# EAGLE board ascender_board (EAGLE 9.0.0)
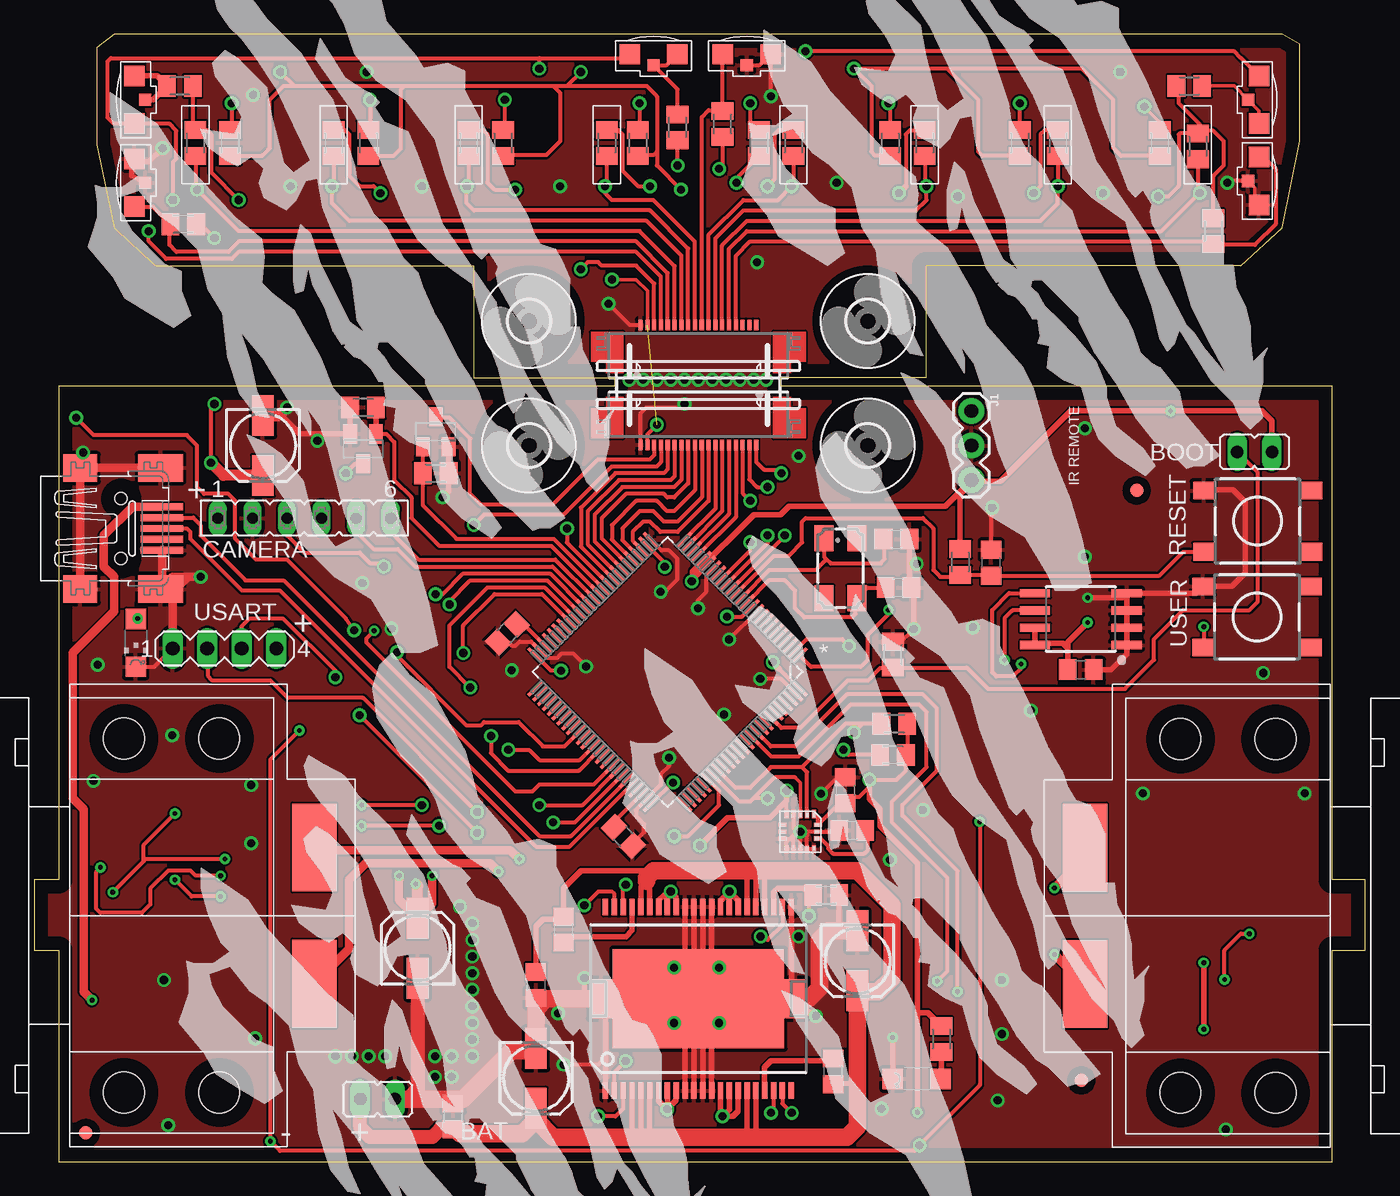
[diagram p2: board, top side]
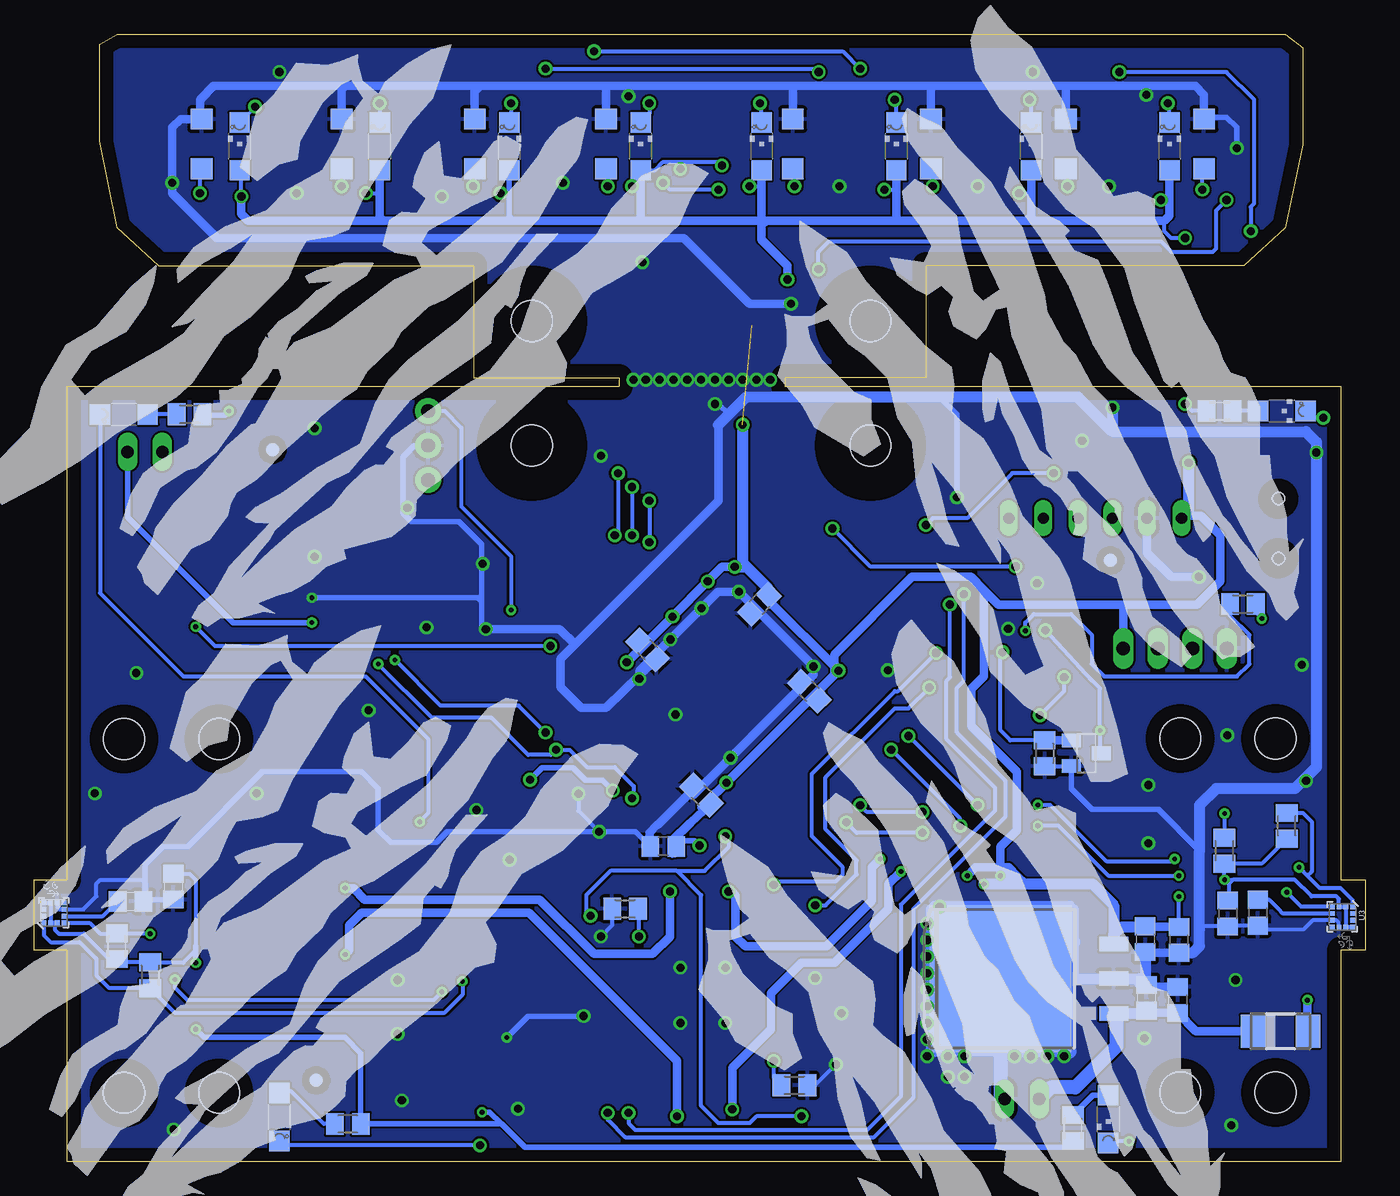
[diagram p3: board, bottom side, seen from below]

Size 97.84 x 82.85 mm. Coordinates in mm from the lower left corner, seen from the top.
Outline: 88.7,65.84 91.75,68.63 93.02,74.98 93.02,82.09 91.75,82.86 5.89,82.86 4.62,81.84 4.62,74.73 5.89,68.63 8.94,65.84 32.31,65.84 32.31,57.61 42.67,57.61 42.67,57 1.83,57 1.83,20.73 0,20.73 0,15.54 1.83,15.54 1.83,0 95.4,0 95.4,15.54 97.84,15.54 97.84,20.73 95.4,20.73 95.4,57 54.86,57 54.86,57.61 65.53,57.61 65.53,65.84 88.7,65.84
Copper layers (1*16): Top 0.035mm / dielectric 1.5mm / Bottom 0.035mm
Design rules "default *": minimum track width 8mil, minimum drill 24mil, track to track 6mil, track to pad 6mil, pad to pad 6mil, via to via 6mil, smd to smd 0mil, copper to edge 40mil, drill to drill 8mil, minimum pad ring 10mil, minimum via ring 8mil, stop-mask expansion 4mil, vias tented up to drill 0mil, thermal gap 10mil

## Footprints (pad centres in the part's own frame; a part is rotated, then mirrored left to right if it is on the bottom)
JP1 = drill 0.914 long: 1 0,-1.27; 2 0,1.27
C0805 = smd 1.3 x 1.5: 1 -0.95,0; 2 0.95,0
153CLV-0505 = smd 3 x 1.6: + 2.2,0; - -2.2,0
FE06 = drill 0.813 long: 1 -6.35,0; 2 -3.81,0; 3 -1.27,0; 4 1.27,0; 5 3.81,0; 6 6.35,0
DO-214AC = smd 1.8 x 2.4: A 2.025,0; C -2.025,0
3,0 = hole 3: 0,0
TO263-3 = smd 1.067 x 2.159: 1 -2.54,-5.791; 2 0,-5.791; 3 2.54,-5.791 | smd 10.8 x 10.41: TAB 0,2.54
HSOP44 = smd 0.4 x 1.2: 1 -6.825,-6.75; 2 -6.175,-6.75; 3 -5.525,-6.75; 4 -4.875,-6.75; 5 -4.225,-6.75; 6 -3.575,-6.75; 7 -2.925,-6.75; 8 -2.275,-6.75; 9 -1.625,-6.75; 10 -0.975,-6.75; 11 -0.325,-6.75; 12 0.325,-6.75; 13 0.975,-6.75; 14 1.625,-6.75; 15 2.275,-6.75; 16 2.925,-6.75; 17 3.575,-6.75; 18 4.225,-6.75; 19 4.875,-6.75; 20 5.525,-6.75; 21 6.175,-6.75; 22 6.825,-6.75; 23 6.825,6.75; 24 6.175,6.75; 25 5.525,6.75; 26 4.875,6.75; 27 4.225,6.75; 28 3.575,6.75; 29 2.925,6.75; 30 2.275,6.75; 31 1.625,6.75; 32 0.975,6.75; 33 0.325,6.75; 34 -0.325,6.75; 35 -0.975,6.75; 36 -1.625,6.75; 37 -2.275,6.75; 38 -2.925,6.75; 39 -3.575,6.75; 40 -4.225,6.75; 41 -4.875,6.75; 42 -5.525,6.75; 43 -6.175,6.75; 44 -6.825,6.75 | smd 12.6 x 7.3: EH@1 0,0 | smd 1.7 x 2.9: EH@2 -7.15,0; EH@3 7.15,0
1X03 = drill 1.016 pad 1.88: 1 0,0; 2 2.54,0; 3 5.08,0
CHIPLED_1206 = smd 1.5 x 1.5: A 0,-1.75; C 0,1.75
CTS406 = smd 1.9 x 1.4: 1 -2.2,-1.2; 2 2.2,-1.2; 3 2.2,1.2; 4 -2.2,1.2
SOT23 = smd 1 x 1.4: 1 -0.95,-1.1; 2 0.95,-1.1; 3 0,1.1
M0805 = smd 1.3 x 1.6: 1 -0.95,0; 2 0.95,0
DTSM-6 = smd 1.55 x 1.3: 1 -3.975,2.25; 2 3.975,2.25; 3 -3.975,-2.25; 4 3.975,-2.25
QFP50P1600X1600X160-100N = smd 1.473 x 0.254: 1 -7.722,5.994; 2 -7.722,5.512; 3 -7.722,5.004; 4 -7.722,4.496; 5 -7.722,3.988; 6 -7.722,3.505; 7 -7.722,2.997; 8 -7.722,2.489; 9 -7.722,2.007; 10 -7.722,1.499; 11 -7.722,0.991; 12 -7.722,0.508; 13 -7.722,0; 14 -7.722,-0.508; 15 -7.722,-0.991; 16 -7.722,-1.499; 17 -7.722,-2.007; 18 -7.722,-2.489; 19 -7.722,-2.997; 20 -7.722,-3.505; 21 -7.722,-3.988; 22 -7.722,-4.496; 23 -7.722,-5.004; 24 -7.722,-5.512; 25 -7.722,-5.994; 51 7.722,-5.994; 52 7.722,-5.512; 53 7.722,-5.004; 54 7.722,-4.496; 55 7.722,-3.988; 56 7.722,-3.505; 57 7.722,-2.997; 58 7.722,-2.489; 59 7.722,-2.007; 60 7.722,-1.499; 61 7.722,-0.991; 62 7.722,-0.508; 63 7.722,0; 64 7.722,0.508; 65 7.722,0.991; 66 7.722,1.499; 67 7.722,2.007; 68 7.722,2.489; 69 7.722,2.997; 70 7.722,3.505; 71 7.722,3.988; 72 7.722,4.496; 73 7.722,5.004; 74 7.722,5.512; 75 7.722,5.994 | smd 0.254 x 1.473: 26 -5.994,-7.722; 27 -5.512,-7.722; 28 -5.004,-7.722; 29 -4.496,-7.722; 30 -3.988,-7.722; 31 -3.505,-7.722; 32 -2.997,-7.722; 33 -2.489,-7.722; 34 -2.007,-7.722; 35 -1.499,-7.722; 36 -0.991,-7.722; 37 -0.508,-7.722; 38 0,-7.722; 39 0.508,-7.722; 40 0.991,-7.722; 41 1.499,-7.722; 42 2.007,-7.722; 43 2.489,-7.722; 44 2.997,-7.722; 45 3.505,-7.722; 46 3.988,-7.722; 47 4.496,-7.722; 48 5.004,-7.722; 49 5.512,-7.722; 50 5.994,-7.722; 76 5.994,7.722; 77 5.512,7.722; 78 5.004,7.722; 79 4.496,7.722; 80 3.988,7.722; 81 3.505,7.722; 82 2.997,7.722; 83 2.489,7.722; 84 2.007,7.722; 85 1.499,7.722; 86 0.991,7.722; 87 0.508,7.722; 88 0,7.722; 89 -0.508,7.722; 90 -0.991,7.722; 91 -1.499,7.722; 92 -2.007,7.722; 93 -2.489,7.722; 94 -2.997,7.722; 95 -3.505,7.722; 96 -3.988,7.722; 97 -4.496,7.722; 98 -5.004,7.722; 99 -5.512,7.722; 100 -5.994,7.722
SO08-EIAJ = smd 0.61 x 2.21: 1 -1.905,-3.378; 2 -0.635,-3.378; 3 0.635,-3.378; 4 1.905,-3.378; 5 1.905,3.353; 6 0.635,3.353; 7 -0.635,3.353; 8 -1.905,3.353
SPARKFUN-DIGITALIC_LGA-12 = smd 0.375 x 0.35: 1 -0.75,0.75; 2 -0.75,0.25; 3 -0.75,-0.25; 4 -0.75,-0.75; 7 0.75,-0.75; 8 0.75,-0.25; 9 0.75,0.25; 10 0.75,0.75 | smd 0.35 x 0.375: 5 -0.25,-0.75; 6 0.25,-0.75; 11 0.25,0.75; 12 -0.25,0.75
ST_LGA16L = smd 0.6 x 0.3: P$1 -1.3,1; P$2 -1.3,0.5; P$3 -1.3,0; P$4 -1.3,-0.5; P$5 -1.3,-1; P$9 1.3,-1; P$10 1.3,-0.5; P$11 1.3,0; P$12 1.3,0.5; P$13 1.3,1 | smd 0.3 x 0.6: P$6 -0.5,-1.3; P$7 0,-1.3; P$8 0.5,-1.3; P$14 0.5,1.3; P$15 0,1.3; P$16 -0.5,1.3
FIDUCIAL_1MM = smd 1 x 1: 1 0,0
SFH3710 = smd 1.52 x 1.6: P$1 -1.75,0; P$2 1.9,0
KPA3010 = smd 1.5 x 1.5: P$1_COL -1.75,0.8; P$2_EM 1.75,0.8 | smd 0.9 x 0.9: P$3-NC 0,0
JSUMO_MOTOR_WITH_WHEEL = smd 3.251 x 6.452: P$1 18,5; P$2 18,-5 | hole 3: 4,-13; 11,-13; 4,13; 11,13
MA04-1 = drill 1.016 long: 1 -3.81,0; 2 -1.27,0; 3 1.27,0; 4 3.81,0
52745-1890 = smd 0.3 x 0.8: 1 -4.25,2.5; 2 -3.75,2.5; 3 -3.25,2.5; 4 -2.75,2.5; 5 -2.25,2.5; 6 -1.75,2.5; 7 -1.25,2.5; 8 -0.75,2.5; 9 -0.25,2.5; 10 0.25,2.5; 11 0.75,2.5; 12 1.25,2.5; 13 1.75,2.5; 14 2.25,2.5; 15 2.75,2.5; 16 3.25,2.5; 17 3.75,2.5; 18 4.25,2.5
32005-201 = smd 3.1 x 0.5: 1 3,1.6; 2 3,0.8; 3 3,0; 4 3,-0.8; 5 3,-1.6 | smd 2.5 x 2: M1 -3,-4.45; M2 -3,4.45 | smd 3.3 x 2: M3 2.9,4.45; M4 2.9,-4.45 | hole 0.9: 0,2.2; 0,-2.2

## Placement (x,y rotation side)
BAT  LiPol  [JP1]  25.25,4.62 90 top
BOOT  [JP1]  89.69,52.17 270 top
C1  [C0805]  63.37,45.75 0 top
C2  18p  [C0805]  63.52,42.19 0 top
C3  100n  [C0805]  70.33,44.02 90 top
C4  2.2uF  [C0805]  34.77,38.84 225 top
C5  2.2uF  [C0805]  43.31,23.9 135 top
C6  100n  [C0805]  44.53,40.97 225 bottom
C7  100n  [C0805]  40.87,34.57 135 bottom
C8  100n  [C0805]  48.79,26.95 135 bottom
C9  100n  [C0805]  52.75,37.62 315 bottom
C10  100n  [C0805]  16.09,12.06 90 bottom
C11  10uF  [C0805]  13.8,11.9 90 bottom
C12  100n  [C0805]  13.7,16.32 270 bottom
C13  10uF  [C0805]  16.19,16.37 270 bottom
C14  10n  [C0805]  60.12,24.36 180 top
C15  100n  [C0805]  59.61,27.31 90 top
C16  100n  [C0805]  51.6,23.18 180 bottom
C17  100n  [C0805]  38.91,17.07 270 top
C18  100n  [C0805]  58.72,6.65 270 top
C19  100n  [C0805]  36.88,13 270 top
C20  [153CLV-0505]  36.88,6.15 270 top
C21  [153CLV-0505]  60.5,14.78 270 top
C22  [153CLV-0505]  28.19,15.7 90 top
C23  100n  [C0805]  30.78,3.35 90 top
C24  [153CLV-0505]  16.81,52.63 270 top
C25  100n  [C0805]  7.91,18.3 270 bottom
C26  100n  [C0805]  76.91,36.17 0 top
C27  100n  [C0805]  10.12,18.25 270 bottom
C28  100n  [C0805]  90.75,19.15 0 bottom
C29  100n  [C0805]  87.61,20.22 270 bottom
CAMERA  [FE06]  19.86,47.29 0 top
D1  [DO-214AC]  6.25,9.6 0 bottom
H1  MOUNT-HOLE3.0  [3,0]  61.26,61.77 0 top
H2  MOUNT-HOLE3.0  [3,0]  36.37,61.77 0 top
H3  MOUNT-HOLE3.0  [3,0]  61.26,52.63 0 top
H4  MOUNT-HOLE3.0  [3,0]  36.37,52.63 0 top
IC1  LM2937  [TO263-3]  24.28,13.46 90 bottom
IC2  MC33932  [HSOP44]  48.82,11.99 0 top
J1  455-1750-1-ND  [1X03]  68.88,55.17 270 top
LED1  [CHIPLED_1206]  7.48,38.13 180 top
LED2  [CHIPLED_1206]  64.86,6.11 90 top
LED3  [CHIPLED_1206]  6.15,55.17 270 bottom
LED4  [CHIPLED_1206]  91.24,54.91 90 bottom
LED5  [CHIPLED_1206]  79.81,3.3 180 bottom
LED6  [CHIPLED_1206]  18.9,3.15 180 bottom
LED7  [CHIPLED_1206]  82.73,74.6 0 bottom
LED8  [CHIPLED_1206]  72.44,74.6 0 bottom
LED9  [CHIPLED_1206]  62.92,74.6 0 bottom
LED10  [CHIPLED_1206]  53.26,74.6 0 bottom
LED11  [CHIPLED_1206]  44.37,74.6 0 bottom
LED12  [CHIPLED_1206]  34.47,74.6 0 bottom
LED13  [CHIPLED_1206]  24.56,74.6 0 bottom
LED14  [CHIPLED_1206]  14.4,74.6 0 bottom
Q1  8MHz  [CTS406]  59.26,43.61 270 top
Q2  BSS123  [SOT23]  24.18,52.37 180 top
Q3  BSS123  [SOT23]  29.51,53.64 0 top
Q4  BSS123  [SOT23]  20.52,30.02 270 bottom
R1  4k7  [M0805]  68.05,44.07 90 top
R2  4k7  [M0805]  63.12,37.26 270 top
R3  4k7  [M0805]  9,40.98 180 bottom
R4  4k7  [M0805]  63.12,29.9 0 top
R5  4k7  [M0805]  63.22,32.18 0 top
R6  4k7  [M0805]  66.68,9.03 90 top
R7  4k7  [M0805]  58.22,19.61 180 top
R8  4k7  [M0805]  41.96,5.64 180 bottom
R9  4k7  [M0805]  54.41,18.59 180 bottom
R10  4k7  [M0805]  24.18,55.42 0 top
R11  4k7  [M0805]  29.51,50.6 180 top
R12  4k7  [M0805]  23.57,30.02 90 bottom
R13  330  [M0805]  10.72,55.17 180 bottom
R14  330  [M0805]  86.41,54.91 0 bottom
R15  330  [M0805]  74.78,2.79 0 bottom
R16  330  [M0805]  21.49,2.49 270 bottom
R17  4k7  [M0805]  5.79,24.69 270 bottom
R18  4k7  [M0805]  85.52,74.6 90 top
R19  330  [M0805]  82.73,74.85 90 top
R20  4k7  [M0805]  75.23,74.85 90 top
R21  330  [M0805]  72.44,74.85 90 top
R22  4k7  [M0805]  65.46,74.85 90 top
R23  330  [M0805]  62.92,74.85 90 top
R24  4k7  [M0805]  55.8,74.85 90 top
R25  330  [M0805]  53.26,74.85 90 top
R26  4k7  [M0805]  42.09,74.85 90 top
R27  330  [M0805]  44.37,74.85 90 top
R28  4k7  [M0805]  31.93,74.85 90 top
R29  330  [M0805]  34.47,74.85 90 top
R30  4k7  [M0805]  22.02,74.85 90 top
R31  330  [M0805]  24.56,74.85 90 top
R32  4k7  [M0805]  11.86,74.85 90 top
R33  330  [M0805]  14.4,74.85 90 top
R34  4k7  [M0805]  86.66,68.38 90 top
R35  22  [M0805]  47.29,76 270 top
R36  4k7  [M0805]  50.6,76.25 270 top
R37  22  [M0805]  10.72,79.04 0 top
R38  4k7  [M0805]  10.97,68.88 0 top
R39  22  [M0805]  84.89,79.04 180 top
R40  4k7  [M0805]  10.36,22.86 270 bottom
R41  4k7  [M0805]  89.31,13.72 90 bottom
R42  4k7  [M0805]  91.74,15.85 270 bottom
RESET  DTSM-6  [DTSM-6]  89.92,47.07 0 top
RUN  DTSM-6  [DTSM-6]  89.87,40.03 0 top
U1  STM32F722XX  [QFP50P1600X1600X160-100N]  46.56,35.99 225 top
U2  I2C EEPROM  [SO08-EIAJ]  76.91,39.88 90 top
U3  SPARKFUN-DIGITALIC_LSM303C  [SPARKFUN-DIGITALIC_LGA-12]  1.7,18 270 bottom
U4  SPARKFUN-DIGITALIC_LSM303C  [SPARKFUN-DIGITALIC_LGA-12]  96.38,18.3 90 bottom
U$1  [SCAR]  25.4,41.5 225 top
U$2  ST_L3GD20H  [ST_LGA16L]  56.31,24.26 270 top
U$3  FIDUCIAL  [FIDUCIAL_1MM]  76.96,5.99 0 top
U$4  FIDUCIAL  [FIDUCIAL_1MM]  81.03,49.33 0 top
U$5  FIDUCIAL  [FIDUCIAL_1MM]  3.81,2.13 0 top
U$6  FIDUCIAL  [FIDUCIAL_1MM]  18.75,44.2 0 bottom
U$7  FIDUCIAL  [FIDUCIAL_1MM]  77.11,5.99 0 bottom
U$8  FIDUCIAL  [FIDUCIAL_1MM]  80.31,52.32 0 bottom
U$9  [SCAR]  28.46,89.05 225 bottom  (outside the outline)
U$10  [SCAR]  34.25,43.94 225 bottom
U$11  SFH3710  [SFH3710]  85.52,74.85 270 bottom
U$12  KPA3010  [KPA3010]  89.2,72.06 270 top
U$13  KPA3010_EM  [KPA3010]  45.52,80.57 0 top
U$14  SFH3710  [SFH3710]  75.23,74.85 270 bottom
U$15  SFH3710  [SFH3710]  65.46,74.85 270 bottom
U$16  SFH3710  [SFH3710]  55.8,74.85 270 bottom
U$17  SFH3710  [SFH3710]  42.09,74.85 270 bottom
U$18  SFH3710  [SFH3710]  31.93,74.85 270 bottom
U$19  SFH3710  [SFH3710]  22.02,74.85 270 bottom
U$20  SFH3710  [SFH3710]  11.86,74.85 270 bottom
U$21  [SCAR]  66.75,103.06 225 top  (outside the outline)
U$22  [SCAR]  18.7,98.49 225 top  (outside the outline)
U$23  [SCAR]  49.73,31.89 150 bottom
U$24  [SCAR]  58.02,57.65 225 top
U$26  JSUMO_MOTOR_WITH_WHEEL  [JSUMO_MOTOR_WITH_WHEEL]  2.61,18.1 0 top
U$27  JSUMO_MOTOR_WITH_WHEEL  [JSUMO_MOTOR_WITH_WHEEL]  95.24,18.07 180 top
U$28  [SCAR]  44.54,74.57 150 bottom
U$29  KPA3010  [KPA3010]  52.37,80.57 0 top
U$30  KPA3010_EM  [KPA3010]  8.18,78.03 90 top
U$31  KPA3010  [KPA3010]  8.18,71.93 90 top
U$32  KPA3010_EM  [KPA3010]  89.2,78.03 270 top
USART  [MA04-1]  14,37.72 0 top
X2  52745-1890  [52745-1890]  48.82,55.17 180 top
X3  52745-1890  [52745-1890]  48.82,58.98 0 top
X4  MINI-USB-SCHIELD-32005-201  [32005-201]  6.4,46.53 0 top

## Tracks (layer width: path | path; a pad name or v marks a point on that pad's centre or on a via)
+3V3  (via drill 0.35, 0.6)  (1 unrouted)
  Top 0.254: v42.47,64.82 44.25,64.82 45.07,64 X3.2 | R39.2 83.94,78.47
  Top 0.305: U1.100 56.21,34.77 v54.28,36.7 55.19,35.79 | v38.73,36.09 37.98,36.09 U1.50 | v46.35,43.72 46.35,43.99 U1.27 | v50.93,40.06 52.02,40.06 U1.11 | 48.34,42.73 48.34,42.98 48.34,43.41 U1.21 | U1.20 49.54,43.85 v48.34,42.65 | v46.96,27.87 46.91,27.87 U1.75 | U$2.P$1 57.61,25.26 U$2.P$16 59.31,26.46 C15.1 59.95,26.8 60.63,26.8 61.39,27.56 v61.39,28.07 63.38,28.07 64.06,28.75 64.06,29.26 | U$2.P$5 55.31,26.52 | R5.2 64.17,29.37 64.06,29.26 | 64.06,29.26 64.06,29.89 R4.2 | v13.01,51.36 13.01,55.42 v13.26,55.68 | X2.17 45.07,53.45 v45.77,54.15 | R37.2 11.67,76 R32.2 12.69,75.8 13.01,75.49 13.01,72.69 v15.04,70.66 | R38.2 12.24,68.89 v13.26,67.87 | R30.2 22.85,75.8 23.16,75.49 23.16,72.44 23.93,71.68 24.94,71.68 v25.45,71.17 | R28.2 33.01,75.8 33.33,75.49 33.33,71.93 33.83,71.42 v35.36,71.42 | R26.2 42.92,75.8 43.23,75.49 43.23,72.82 44.37,71.68 v45.26,71.68 | v47.3,73.2 R35.2 | R36.2 50.6,73.2 v50.34,72.95 | R24.2 54.72,75.8 54.41,75.49 54.41,72.19 v53.9,71.68 | R20.2 74.28,75.8 73.97,75.49 73.97,71.68 v73.46,71.17 | 64.06,71.68 64.06,75.49 64.37,75.8 R22.2 | R34.2 86.67,72.44 87.43,73.2 87.43,74.98 86.67,75.74 85.72,75.74 85.65,75.68 | 85.65,75.68 R18.2 84.19,75.55 84.12,75.49 84.12,71.68 83.36,70.92 v82.6,70.92 | 85.65,75.68 85.65,76.25 84.12,77.78 84.12,78.86 R39.2 | v13.72,19.51 11.58,19.51 v10.36,20.73
  Top 0.406: 54.79,36.2 v54.28,36.7 | U2.8 73.56,38.1 | 73.56,38.1 U2.7 | 64.06,71.68 v63.55,71.17 | v48.95,23.24 50.98,25.27 54.07,25.27 55.31,26.52 v55.31,27.29 | 73.56,38.1 75.59,38.1 75.96,37.73 C26.1 75.96,38.17 v77.42,39.62 | BOOT.2 90.96,54.43 90.22,55.17 v83.52,55.17 76.2,55.17 71.02,49.99 68.99,49.99 | 68.99,49.99 J1.3 66.95,48.16 55.47,48.16 54.86,47.55 52.91,47.55 48.55,43.19 | R1.2 68.05,49.05 68.99,49.99 | v48.34,42.65 48.34,42.73 48.55,42.95 48.55,43.19 | 48.55,43.19 48.34,42.98 | v61.39,28.07 61.39,26.7 62.18,25.91 62.18,24.69 64.92,21.95 64.92,10.97 | 64.92,10.97 v64.92,3.66 | R6.2 65.69,10.97 64.92,10.97 | v85.95,9.75 v85.95,14.63
  Top 0.61: v26.82,21.03 26.82,19.27 C22.+ 29.26,18.96 v29.26,21.03
  Top 0.813: C24.+ 13.94,50.43 v13.01,51.36 | C22.+ 28.19,20.27 v28.04,20.42
  Bottom 0.305: 39.04,36.4 v38.73,36.09 | C7.1 40.55,34.27 39.95,34.88 | C6.1 43.92,41.28 43.61,40.97 | C9.1 53.05,38.22 52.91,38.08 | C8.1 48.34,26.49 | 50.75,22.68 50.94,22.48 | R13.2 12.75,55.17 v13.26,55.68 | 44.53,72.69 LED11.A | v15.04,70.66 14.4,70.66 | v13.26,67.87 14.28,67.87 14.78,68.38 14.78,69.27 14.4,69.65 | v25.45,71.17 24.56,71.17 | v35.36,71.42 34.47,71.42 | v45.26,71.68 44.37,71.68 | LED10.A 52.22,72.85 51.61,73.46 50.34,73.46 | 50.34,73.46 47.55,73.46 v47.3,73.2 | v50.34,72.95 50.34,73.46 | v53.9,71.68 53.26,71.68 | v73.46,71.17 72.44,71.17 | v82.6,70.92 82.6,72.72 | R14.2 85.39,54.85 | U4.3 96.32,17.55 | 96.32,17.55 U4.2 U4.9 U4.10 | U3.10 U3.9 U3.2 U3.3 1.95,19.32 2.13,19.51 3.96,19.51 5.18,20.73 9.75,20.73 | 9.75,20.73 10.06,20.42 10.06,19.27 C27.1 | C12.1 13.7,19.49 v13.72,19.51 | 9.75,20.73 v10.36,20.73 R40.2 7.62,21.91 R17.2 | 96.32,17.55 96.32,17.07 96.01,16.76 94.18,16.76 92.32,14.9 R42.2 91.51,14.67 R41.2 89.27,14.63 86.87,14.63 85.95,15.54 85.95,15.85 85.95,20.73 86.4,21.17 C29.1
  Bottom 0.406: LED9.A 62.92,71.17 | 62.92,71.17 62.92,69.52 62.53,69.14 | 62.92,71.17 v63.55,71.17 | 63.5,2.79 R15.2 73.83,7.99 74.98,9.14 85.34,9.14 v85.95,9.75 | 63.5,2.79 61.77,1.07 21.96,1.07 R16.2 | 50.94,23.6 49.3,23.6 v48.95,23.24 | v55.31,27.29 56.06,28.04 57.3,28.04 58.22,28.96 60.5,28.96 v61.39,28.07 | 85.39,54.85 83.83,54.85 v83.52,55.17 | v77.42,39.62 83.21,39.62 90.96,47.37 BOOT.2 | 63.5,2.79 64.36,3.66 v64.92,3.66 | v85.95,14.63 85.95,15.85
  Bottom 0.61: v54.28,36.7 52.91,38.08 v50.93,40.06 v48.34,42.65 47.27,43.72 v46.35,43.72 | 43.61,40.97 39.04,36.4 | 39.04,36.4 39.04,35.79 39.95,34.88 v46.96,27.87 48.34,26.49 48.79,26.04 | C8.1 49.61,24.93 50.94,23.6 50.75,23.4 C16.1 50.75,22.68 | 39.04,36.4 39.04,37.26 33.33,42.98 29.01,42.98 28.04,42.01 | 28.04,42.01 26.98,40.95 17.68,40.95 | LED14.A 14.4,70.66 14.4,69.65 14.4,69.52 14.78,69.14 24.94,69.14 | 24.94,69.14 34.59,69.14 | 34.59,69.14 43.99,69.14 44.12,69.01 44.37,69.01 | 53.14,69.14 44.5,69.14 44.37,69.01 | 53.14,69.14 62.53,69.14 72.19,69.14 | 72.19,69.14 82.09,69.14 82.6,69.65 v82.6,70.92 | 82.6,72.72 LED7.A | LED8.A 72.44,71.17 72.44,69.39 72.19,69.14 | LED10.A 53.26,71.68 53.26,69.27 53.14,69.14 | LED11.A 44.37,71.68 44.37,69.01 | LED13.A 24.56,71.17 24.56,69.52 24.94,69.14 | LED12.A 34.47,71.42 34.47,69.27 34.59,69.14 | 44.37,69.01 44.37,67.74 42.47,65.84 v42.47,64.82 | 24.99,20.42 25.6,21.03 | 25.6,21.03 v26.82,21.03 26.82,23.16 25.6,24.38 25.6,28.65 28.96,32 28.96,34.75 28.04,35.66 28.04,42.01 | 25.6,20.42 25.6,21.03 | 25.6,21.03 26.21,21.64 28.65,21.64 v29.26,21.03 | C12.1 16.24,17.27 | 13.34,47.47 12.12,47.47 10.67,46.02 10.67,42.67 12.39,40.95 17.68,40.95 | USART.4 17.81,40.82 17.68,40.95
  Bottom 0.813: C13.1 16.24,17.27 17.93,17.27 18.49,16.71 IC1.3 18.49,18.85 20.07,20.42 24.99,20.42 25.6,20.42 v28.04,20.42 | 13.75,17.22 C12.1 | v13.01,51.36 13.01,47.8 13.34,47.47 CAMERA.1 | v46.35,43.72 45.49,43.72 | C6.1 43.92,42.15 45.49,43.72 | v45.77,54.15 45.77,43.99 45.49,43.72
ADC0
  Top 0.305: X2.4 51.57,47.36 U1.22
ADC1
  Top 0.305: X2.5 51.07,47.58 U1.23
ADC1_S  (via drill 0.6)
  Top 0.305: R18.1 85.52,71.3 v85.65,71.17 82.86,68.38 52.38,68.38 51.07,67.07 X3.14
  Bottom 0.305: v85.65,71.17 85.65,72.83 U$11.P$2
ADC2
  Top 0.305: X2.6 50.57,47.8 U1.24
ADC2_S  (via drill 0.6)
  Top 0.305: X3.13 50.57,67.33 52.38,69.14 73.97,69.14 75.23,70.41 v75.23,71.68 R20.1
  Bottom 0.305: v75.23,71.68 U$14.P$2
ADC3
  Top 0.305: X2.7 50.07,47.98 U1.25
ADC3_S  (via drill 0.6)
  Top 0.305: X3.12 50.07,67.85 52.12,69.9 64.82,69.9 65.58,70.66 v65.58,71.68 65.46,71.81 R22.1
  Bottom 0.305: v65.58,71.68 65.58,72.83 U$15.P$2
ADC4
  Top 0.305: X2.8 49.57,48.55 47.3,46.28 46.02,46.28 45.26,47.04 44.76,47.04 43.99,46.28 43.99,45.63 U1.28
ADC4_S  (via drill 0.6)
  Top 0.305: X3.11 49.57,68.11 52.12,70.66 54.66,70.66 v55.68,71.68 55.8,71.81 R24.1
  Bottom 0.305: v55.68,71.68 55.68,72.83 U$16.P$2
ADC5
  Top 0.305: X2.9 49.07,48.81 47.3,47.04 46.28,47.04 45.52,47.8 44.5,47.8 43.23,46.53 43.23,45.68 U1.29
ADC6
  Top 0.305: X2.10 48.57,49.33 47.04,47.8 46.53,47.8 45.77,48.56 44.25,48.56 42.47,46.79 42.47,45.72 U1.30
ADC6_S  (via drill 0.6)
  Top 0.305: X3.9 48.57,67.61 45.52,70.66 42.47,70.66 41.96,71.17 v41.96,71.68 42.09,71.81 R26.1
  Bottom 0.305: v41.96,71.68 41.96,72.83 U$17.P$2
ADC7
  Top 0.305: X2.11 48.07,49.85 47.04,48.82 46.53,48.82 46.28,49.07 43.48,49.07 41.71,47.3 41.71,45.8 U1.31
ADC7_S  (via drill 0.6)
  Top 0.305: X3.8 48.07,67.09 45.26,69.9 32.31,69.9 31.8,70.41 v31.8,71.68 31.93,71.81 R28.1
  Bottom 0.305: v31.8,71.68 31.8,72.83 U$18.P$2
ADC8
  Top 0.305: X2.12 47.57,50.11 47.04,49.58 43.23,49.58 41.2,47.55 41.2,45.59 U1.32
ADC8_S  (via drill 0.6)
  Top 0.305: X3.7 47.57,66.58 45.01,69.14 23.16,69.14 21.89,70.41 v21.89,71.68 22.02,71.81 R30.1
  Bottom 0.305: v21.89,71.68 21.89,72.83 U$19.P$2
ADC9
  Top 0.305: X2.13 47.07,50.37 46.79,50.09 42.98,50.09 40.69,47.8 40.69,45.38 U1.33
ADC9_S  (via drill 0.6)
  Top 0.305: X3.6 47.07,65.81 44.5,68.38 15.04,68.38 v11.99,71.42 11.86,71.55 R32.1
  Bottom 0.305: v11.99,71.42 11.99,72.83 U$20.P$2
ADC10
  Top 0.305: X2.14 46.57,50.89 46.28,50.6 42.72,50.6 40.18,48.06 40.18,45.21 U1.34
ADC11  (via drill 0.6)
  Top 0.305: CAMERA.3 18.59,46.02 19.86,44.76 23.93,44.76 24.69,43.99 25.45,43.99 v25.7,43.74 | v39.17,46.53 39.17,45.5 U1.35
  Bottom 0.305: v25.7,43.74 36.37,43.74 v39.17,46.53
BOOT
  Top 0.305: U1.94 54.91,31.88 56.31,31.88 59.79,35.36 61.27,35.36 62.2,36.3 63.12,36.3 R2.2 68.54,36.31 70.1,34.75 80.16,34.75 82.3,36.88 82.3,38.41 84.43,40.54 89.31,40.54 89.92,41.15 89.92,50.67 BOOT.1
CAM_CLK
  Top 0.305: CAMERA.5 23.67,46.28 24.94,45.01 26.72,45.01 27.99,43.74 38.09,43.74 U1.39
CAM_SI
  Top 0.305: CAMERA.6 26.21,46.28 28.25,44.25 38.3,44.25 U1.38
ENC_LEFT_SCL  (via drill 0.35, 0.6)
  Top 0.305: v34.85,30.28 36.37,30.28 37.13,29.52 40.08,29.52 U1.63 | v29.77,24.69 v24.08,24.69 | v13.72,21.03 11.89,21.03 11.51,21.41 9.86,21.41 8.55,20.1 8.55,18.92 7.92,18.29 4.88,18.29 4.57,18.59 4.57,21.34 v4.88,21.64
  Bottom 0.305: v29.77,24.69 29.77,25.2 v34.85,30.28 | v24.08,24.69 22.55,24.69 18.9,21.03 v13.72,21.03 | v4.88,21.64 4.27,21.03 | R17.1 4.61,25.64 3.96,24.99 3.96,21.34 4.27,21.03 | U3.1 0.94,19.23 1.83,20.12 3.35,20.12 4.27,21.03
ENC_LEFT_SDA  (via drill 0.35, 0.6)
  Top 0.305: v33.58,31.29 33.58,30.02 34.85,28.75 40.03,28.75 U1.64 | v28.5,26.21 v24.08,26.21 | 8.08,22.1 8.23,22.25 v14.02,22.25 | 8.08,22.1 v5.79,19.81 | 8.08,22.1 8.08,23.32 v10.36,25.6
  Bottom 0.305: v28.5,26.21 v33.58,31.29 | v24.08,26.21 23.16,26.21 19.05,22.1 14.17,22.1 v14.02,22.25 | v10.36,25.6 R40.1 | U3.4 4.73,18.75 v5.79,19.81
ENC_RIGHT_SCL  (via drill 0.35)
  Top 0.305: v66.36,13.28 67.11,14.02 67.11,20.88 63.04,24.94 63.04,26.47 65.58,29.01 65.58,33.07 65.08,33.58 59.99,33.58 56.19,29.77 54.18,29.77 U1.90
  Bottom 0.305: v66.36,13.28 66.36,12.28 67.67,10.97 87.51,10.97 R41.1 89.34,12.8 92.35,12.8 93.27,13.72 93.27,14.94 94.49,16.15 96.62,16.15 97.13,16.66 U4.1
ENC_RIGHT_SDA  (via drill 0.35)
  Top 0.305: v67.87,12.5 67.87,21.39 63.8,25.45 63.8,26.21 66.34,28.75 66.34,33.33 65.33,34.34 59.74,34.34 55.93,30.53 54.14,30.53 U1.91 | v87.48,13.41 87.48,15.54 88.7,16.76 v89.31,16.76
  Bottom 0.305: v67.87,12.5 68.48,11.89 86.56,11.89 87.48,12.8 v87.48,13.41 | U4.4 93.75,17.55 92.96,16.76 91.78,16.76 | 91.78,16.76 R42.1 | v89.31,16.76 91.78,16.76
FRONT_GPIO  (via drill 0.6)
  Top 0.305: X2.3 52.07,49.12 v52.63,48.56 | v52.63,45.52 52.63,44.9 U1.17
  Bottom 0.305: v52.63,48.56 v52.63,45.52
FRONT_SCL  (via drill 0.6)
  Top 0.305: v55.17,46.02 55.17,46.01 U1.15 | X2.1 53.07,51.43 53.65,50.85 54.66,50.85 v54.91,50.6
  Bottom 0.305: v54.91,50.6 54.91,46.28 v55.17,46.02
FRONT_SDA  (via drill 0.6)
  Top 0.305: X2.2 52.57,50.15 53.14,49.58 v53.9,49.58 | v53.9,46.02 53.9,45.45 U1.16
  Bottom 0.305: v53.9,49.58 v53.9,46.02
GND  (via drill 0.35, 0.6)
  Top 0.254: U$12.P$2_EM 90,70.37 89.71,70.66 89.71,71.55 U$12.P$3-NC
  Top 0.305: 49.87,43.57 U1.19 49.4,43.08 49.4,41.89 48.79,41.28 v48.79,40.67 | U1.10 v51.08,38.38 | U1.99 55.91,34.46 54.89,35.49 v53.36,35.49 | v40.56,36.4 39.65,37.31 38.73,37.31 38.43,37.01 37.75,37.01 U1.49 36.53,38.23 35.69,38.23 35.38,37.92 35.08,37.92 34.76,38.24 C4.2 | v46.05,41.89 46.35,41.89 47.27,42.8 47.27,44.33 46.66,44.93 46.09,44.93 U1.26 | v46.66,29.69 46.66,29.09 46.05,28.48 46.05,27.69 U1.74 | 44.52,26.17 U1.74 | C5.1 43.92,23.3 44.83,24.21 44.83,24.82 44.22,25.43 44.22,25.86 U1.74 | U$2.P$4 55.81,24.5 56.06,24.26 | U$2.P$8 55.56,23.76 | 55.56,23.76 55.81,24.01 | U$2.P$9 55.31,23.51 55.56,23.76 | U$2.P$10 55.81,24.01 | 55.81,24.01 55.93,24.13 | U$2.P$11 56.31,23.75 55.93,24.13 | U$2.P$13 U$2.P$12 56.81,24.01 56.56,24.26 | 56.56,24.26 U$2.P$15 59.45,24.26 C14.2 | 56.56,24.26 v56.31,24.26 56.06,24.26 | C15.2 58.94,28.16 v57.84,27.05 | 56.06,24.26 55.93,24.13 | v38.91,7.16 41.49,7.16 41.99,7.67 | v56.19,16.56 55.64,16.56 | 37.64,11.99 37.05,11.99 C19.2 | X4.M2 3.4,51.91 v3.61,52.12 | 80.47,37.8 U2.1 | R2.1 63.71,38.21 v64.64,39.14 | 70.33,47.55 C3.2 | X2.18 44.57,54.98 45.01,55.42 47.55,55.42 v47.8,55.68 | R11.1 Q3.2 | X3.1 43.78,61.48 v42.22,63.04 | U$29.P$3-NC 53.33,80.57 U$29.P$2_EM 54.12,78.31 v54.15,78.28 | U$12.P$3-NC 87.81,72.06 v87.68,71.93 | LED1.C 8.84,36.38 USART.1
  Top 0.406: IC2.11 48.49,11.66 IC2.EH@1 | IC2.EH@2 41.99,11.66 42.29,11.66 42.34,11.61 | IC2.33 49.14,12.5 | 49.14,12.5 49.14,12.31 | 49.14,12.31 IC2.EH@1 | IC2.35 47.84,12.96 IC2.EH@1 | IC2.34 48.49,12.31 IC2.EH@1 | IC2.32 49.79,13.41 49.79,13.15 49.14,12.5 | IC2.12 49.14,12.31 | IC2.13 49.79,11.01 IC2.EH@1 | IC2.10 47.84,11.01 48.44,11.61 | 48.56,11.73 IC2.EH@1 | IC2.23 55.64,16.56 55.64,12.72 55.42,12.5 | 55.42,12.5 54.66,11.73 48.56,11.73 | 48.56,11.73 48.44,11.61 | 55.42,12.5 55.93,11.99 IC2.EH@3 57.24,10.72 v57.45,10.72 | IC2.1 41.99,7.67 41.99,11.26 42.34,11.61 | 42.34,11.61 42.47,11.73 48.31,11.73 48.44,11.61 | R7.1 59.17,17.05 59.23,16.98 | v40.44,13.51 40.44,12.24 40.18,11.99 | U2.4 U2.3 U2.2 U2.1 80.29,37.31 79.15,36.17 C26.2 | 64.49,39.3 v64.64,39.14 64.64,42.02 C2.2 64.32,42.34 64.32,43.89 | Q3.2 30.46,49.26 v30.02,48.82 | 18.09,54.91 19.52,53.48 Q2.2 R10.1 | U$31.P$3-NC 7.16,72.44 7.16,73.46 8.43,73.46 v9.45,74.47 | RESET.1 86,49.38 88.09,49.38 89,48.46 89,43.28 88,42.28 RUN.1 85.39,41.78 U2.4 | v77.42,41.45 79.96,41.45 U2.4 | v70.41,48.06 70.41,47.63 70.33,47.55 | C1.2 64.32,43.89 | v64.87,43.94 64.37,43.94 64.32,43.89 | v63.09,9.14 63.11,9.13 LED2.C
  Top 0.61: 64.49,45.48 C1.2 | 9.42,41.96 X4.M4 | X4.5 9.4,42.18 X4.M4 | X4.M1 X4.M2 X4.M3 | X4.M4 10.2,42.98 v12.24,42.98 11.28,42.98 10.19,41.89 USART.1 | U$31.P$2_EM 6.94,73.68 7.16,73.46 | v50.34,14.28 48.82,14.28 IC2.EH@1 48.82,13.41 49.79,13.41
  Top 0.813: C23.2 30.87,4.2 31.29,4.62 | C24.- 18,54.83 18.09,54.91 v18.59,55.42
  Top 1.016: C22.- 28.19,5.38 27.43,4.62
  Top 1.27: IC2.EH@2 40.18,11.99 37.64,11.99 36.88,11.23 C20.- 36.71,8.18 35.1,8.18 31.55,4.62 31.29,4.62 27.43,4.62 BAT.1 | C21.- 59.23,16.98 58.38,16.98 57.71,16.31 57.71,12.75 56.95,11.99 IC2.EH@3
  Bottom 0.305: 47.57,41.89 v48.79,40.67 | C7.2 41.47,35.48 41.17,35.18 | C6.2 44.53,40.37 44.07,39.91 | C9.2 52.15,37.31 51.99,37.47 | C8.2 49.39,26.96 49.4,26.95 | C16.2 52.45,22.94 | v57.84,27.05 57.84,25.78 v56.31,24.26 | R8.1 40.44,5.64 v38.91,7.16 | R9.2 55.36,17.39 v56.19,16.56 | 52.8,23.5 52.63,23.67 | v54.15,78.28 54.15,78.79 54.41,79.05 | R12.1 Q4.2 | U4.8 96.11,19.04 96.11,18.74 95.93,18.56 95.64,18.56 U4.6 94.22,18.55 93.27,19.51 93.27,20.42 92.96,20.73 89.92,20.73 89.61,20.42 89.61,19.33 89.67,19.27 | U3.8 1.97,17.27 1.97,17.56 2.14,17.74 2.44,17.74 U3.6 3.89,17.75 4.57,17.07 7.63,17.07 C25.2 10.07,17.36 C27.2 11.96,17.3 12.19,17.07 | C28.2 89.68,19.27 89.67,19.27 | C29.2 89.67,19.27
  Bottom 0.406: 64.95,41.2 64.95,39.45 v64.64,39.14 | 64.95,41.2 64.95,45.39 66.6,47.04 70.1,47.04 70.71,47.65 70.71,47.75 | 64.95,41.2 65.2,41.45 v77.42,41.45 | v47.8,55.68 47.55,55.68 46.79,54.91 | v30.02,48.82 30.02,54.91 31.29,56.19 | v9.45,74.47 9.45,76 10.21,76.76 11.71,76.76 U$20.P$1 | J1.2 69.9,52.63 70.71,51.82 70.71,47.75 | 70.71,47.75 v70.41,48.06 | C16.2 53.63,24.26 v56.31,24.26 67.49,24.26 68.28,23.47 71.63,23.47 72.54,24.38 72.54,27.43 73.76,28.65 81.08,28.65 86.56,23.16 88.39,23.16 89.68,21.88 89.68,19.27 C29.2 | v57.45,10.72 61.52,10.72 v63.09,9.14 | Q4.2 21.62,27.41 20.12,25.91 15.24,25.91 12.19,22.86
  Bottom 0.61: v53.36,35.49 53.36,36.09 51.99,37.47 v51.08,38.38 47.57,41.89 v46.05,41.89 44.07,39.91 v40.56,36.4 40.56,35.79 41.17,35.18 v46.66,29.69 49.4,26.95 49.81,26.95 51.99,24.77 52.04,24.77 52.63,24.18 52.63,23.67 52.63,23.36 C16.2 | C9.2 55.82,33.35 57.63,33.35 59.16,34.88 59.16,36.96 58.09,38.02 | v12.24,42.98 14.28,42.98 16.05,44.76 CAMERA.2 | 58.09,38.02 47.55,48.56 47.55,54.15 | 46.79,54.91 46.28,55.42 | v64.64,39.14 59.21,39.14 58.09,38.02 | U$20.P$1 11.86,78.41 12.5,79.05 21.89,79.05 | 21.89,79.05 32.05,79.05 | 32.05,79.05 42.22,79.05 | 42.22,79.05 54.41,79.05 55.68,79.05 | 55.68,79.05 65.08,79.05 | 65.08,79.05 74.98,79.05 | 74.98,79.05 84.63,79.05 85.65,78.03 85.65,76.73 U$11.P$1 87.07,76.6 87.68,76 v87.68,71.93 87.68,71.17 84.38,67.87 50.09,67.87 45.26,63.04 v42.22,63.04 | U$14.P$1 75.23,78.79 74.98,79.05 | U$15.P$1 65.46,78.66 65.08,79.05 | U$16.P$1 55.8,78.92 55.68,79.05 | U$17.P$1 42.09,78.92 42.22,79.05 | U$18.P$1 31.93,78.92 32.05,79.05 | U$19.P$1 22.02,78.92 21.89,79.05 | C12.2 16.04,15.37 16.14,15.47 | C11.2 16.04,12.85 16.19,13.01 16.64,13.01 16.64,13.46
  Bottom 0.813: C10.2 16.64,13.46 IC1.2 21.23,13.46 21.49,13.72 21.49,16.15 21.49,18.54 21.74,18.8 31.65,18.8 31.9,18.54 31.9,8.38 31.65,8.13 26.82,8.13 21.74,8.13 | C10.2 16.19,13.01 C13.2 16.14,15.47 | 15.94,12.75 C10.2 | 18.59,53.65 4.37,53.65 3.61,52.88 v3.61,52.12 3.61,29.01 5.18,27.43 10.97,27.43 12.19,26.21 12.19,22.86 12.19,17.07 12.19,15.85 12.67,15.37 C12.2 | v18.59,55.42 18.59,53.65 | 18.59,53.65 21.13,56.19 31.29,56.19 45.52,56.19 46.79,54.91 47.55,54.15
  Bottom 1.016: 26.82,8.13 26.82,4.93 BAT.1 | 21.74,8.13 21.74,15.9 21.49,16.15
  other vias: 26.26,39.17 47.04,14.27 47.04,10.21 50.34,10.21 56.18,51.87 35.1,36.12 53.14,66.09 67.87,70.92 58.98,71.93 38.66,71.68 28.5,71.68 24.43,80.06 18.85,71.68 78.54,71.17 79.81,80.06 48.82,57.45 47.8,57.45 46.79,57.45 45.77,57.45 44.75,57.45 43.74,57.45 49.83,57.45 50.85,57.45 51.87,57.45 52.88,57.45 53.8,57.45 29.46,6.25 30.68,6.25 29.46,7.77 30.68,7.77 25.81,7.77 24.59,7.77 23.37,7.77 22.15,7.77 32.21,7.77 32.21,8.99 32.21,10.21 32.21,11.43 32.21,12.65 32.21,13.87 32.21,15.09 32.21,16.31 32.21,17.53 31.29,18.75 24.13,42.52 20.83,52.98 4.67,36.53 15.95,27.69 15.95,23.42 16.26,9.09 38.51,10.92 70.82,4.52 62.28,3.91 71.12,9.4 71.12,13.36 65.33,25.86 62.89,22.2 73.25,33.17 68.99,39.27 77.22,44.45 77.22,53.9 50.7,32.87 90.32,35.92 87.58,2.39 9.86,2.69 10.16,31.34 16.1,78.38 81.48,27.08 9.55,13.36 93.37,27.08 4.37,27.99
  pour Top: 0.3,85.34 96.62,85.34 96.62,-4.27 0.3,-4.27
  pour Bottom: -1.52,85.04 97.84,85.04 97.84,-9.75 -1.52,-9.75
IR_A  (via drill 0.6)
  Top 0.305: X2.15 46.07,51.4 45.77,51.1 42.47,51.1 38.91,47.55 33.07,47.55 v32.31,46.79 | Q2.3 23.59,51.27 v22.91,50.6
  Bottom 0.305: v22.91,50.6 25.96,50.6 29.26,47.3 31.8,47.3 v32.31,46.79
IR_A_CONTROLL
  Top 0.305: Q2.1 25.88,53.48 26.47,52.88 26.47,50.09 27.74,48.82 27.74,47.3 29.77,45.26 38.01,45.26 U1.37
  Top 0.406: R10.2 Q2.1
IR_A_S  (via drill 0.6)
  Top 0.305: X3.4 46.07,65.03 44.25,66.85 15.04,66.85 14.53,66.34 9.7,66.34 8.43,67.61 v8.43,68.38 | R33.1 16.75,73.9 17.32,74.47 17.32,78.03 18.34,79.05 19.1,79.05 | 19.1,79.05 27.23,79.05 | 27.23,79.05 38.15,79.05 | 38.15,79.05 39.17,79.05 | 39.17,79.05 45.01,79.05 45.77,78.28 45.77,74.22 | R29.1 34.53,73.97 37.64,73.97 38.66,74.98 38.66,78.54 38.15,79.05 | R31.1 26.41,73.9 26.98,74.47 26.98,78.79 27.23,79.05 | 45.77,74.22 45.52,73.97 44.44,73.97 R27.1 | v18.09,80.06 19.1,79.05 | 45.77,74.22 45.77,73.2 v47.55,71.42 | v51.61,71.93 51.61,72.25 R25.1 | v40.18,80.06 39.17,79.05 | R21.1 69.71,73.9 69.39,74.22 69.39,78.03 67.11,80.31 | 67.11,80.31 v60.25,80.31 61.52,79.05 61.52,74.22 61.77,73.97 62.85,73.97 R23.1 | R19.1 79.87,73.9 79.3,74.47 79.3,78.03 77.01,80.31 67.11,80.31
  Bottom 0.305: v18.09,80.06 10.21,80.06 8.18,78.03 8.18,70.41 8.43,70.16 v8.43,68.38 | v47.55,71.42 51.1,71.42 v51.61,71.93 | v60.25,80.31 40.44,80.31 v40.18,80.06
IR_B
  Top 0.305: X2.16 45.57,51.92 45.26,51.61 41.45,51.61 38.15,48.31 32.82,48.31 32.05,49.07 32.05,53.14 30.53,54.66 29.6,54.66 Q3.3
IR_B_CONTROLL
  Top 0.305: Q3.1 R11.2 28.57,48.24 31.04,45.77 38.18,45.77 U1.36
IR_B_S  (via drill 0.6)
  Top 0.305: X3.3 45.57,64.52 44.25,65.84 41.71,65.84 41.45,66.09 40.69,66.09 v40.18,65.58 | 37.13,81.08 5.64,81.08 5.38,80.82 5.38,76.76 5.87,76.28 U$30.P$1_COL 6.9,76.25 9.96,76.25 10.46,75.74 10.46,73.71 10.21,73.46 v10.21,70.66 | 37.13,81.08 43.48,81.08 U$13.P$1_COL 43.77,81.87 | U$32.P$1_COL 88.71,81.08 88.7,81.08 88.19,81.58 v56.69,81.58 | v37.13,80.31 37.13,81.08
  Bottom 0.305: v56.69,81.58 38.41,81.58 v37.13,80.31 | v40.18,65.58 40.18,66.85 39.42,67.61 15.04,67.61 14.28,66.85 11.23,66.85 10.97,67.11 10.97,69.9 v10.21,70.66
IR_FRONT_S
  Top 0.305: U$29.P$1_COL 50.6,81.34 R36.1 50.53,77.27 49.58,77.27 49.07,76.75 X3.10
IR_LEFT_S
  Top 0.305: X3.5 46.57,65.29 44.25,67.61 15.04,67.61 14.28,66.85 10.46,66.85 9.96,67.36 9.96,68.82 R38.1 8.72,70.18 U$31.P$1_COL 6.91,70.14
IR_REMOTE  (via drill 0.35)
  Top 0.305: U1.1 57.1,36.37 60.76,36.37 61.27,36.88 61.27,38.71 62.79,40.23 v62.79,40.54
  Bottom 0.305: J1.1 67.67,55.17 66.45,53.95 66.45,48.16 62.79,44.5 v62.79,40.54
IR_RIGHT_S
  Top 0.305: X3.15 51.57,66.56 52.63,67.61 86.48,67.61 R34.1 86.73,67.36 89.71,67.36 91.24,68.89 91.24,72.95 90.38,73.81 U$12.P$1_COL
KEY  (via drill 0.35, 0.6)
  Top 0.305: U1.2 56.76,38.41 59.38,38.41 v59.89,37.9 | v85.95,39.32 85.95,37.84 RUN.3
  Bottom 0.305: v59.89,37.9 84.53,37.9 v85.95,39.32
LED  (via drill 0.35)
  Top 0.305: U1.67 41.14,27.74 37.13,27.74 36.63,27.23 35.36,27.23 24.43,38.15 24.43,38.46 v24.99,39.01
  Bottom 0.305: v24.99,39.01 24.99,39.62 24.38,40.23 21.64,40.23 20.12,38.71 20.12,36.58 19.2,35.66 9.45,35.66 8.53,36.58 8.53,38.71 9.95,40.13 R3.2
LED_BACK  (via drill 0.6)
  Top 0.305: U1.60 38.98,30.53 37.39,30.53 35.61,32.31 33.07,32.31 32.82,32.05 31.8,32.05 26.67,37.19 v26.67,37.44
  Bottom 0.305: R12.2 26.1,30.97 26.82,31.7 26.82,37.29 v26.67,37.44
  Bottom 0.61: Q4.1 R12.2
MOTOR_ENABLE  (via drill 0.6)
  Top 0.305: IC2.3 43.29,3.92 42.72,3.35 v41.45,3.35 | v56.95,18.09 56.95,19.29 R7.2 | v47.04,23.93 48.06,23.93 50.34,26.21 50.34,27.25 U1.81
  Top 0.406: IC2.25 54.34,19.8 54.66,20.12 56.51,20.12 R7.2
  Bottom 0.305: v41.45,3.35 44.76,3.35 45.26,2.85 47.55,2.85 48.82,4.12 48.82,19.61 50.6,21.39 | 50.6,21.39 55.49,21.39 R7.2 57.27,18.41 v56.95,18.09 | 50.6,21.39 48.56,21.39 46.79,23.16 46.79,23.67 v47.04,23.93
N$1
  Top 0.305: U1.12 54.01,42.72 55.17,42.72 55.93,41.96 55.93,40.69 56.62,40.01 60.12,40.01 60.38,40.26 60.38,41.33 Q1.3 61.23,42.19 C2.1
N$2
  Top 0.305: 57.65,45.81 Q1.1 58.06,44.46 58.24,44.27 | 58.24,44.27 58.55,43.97 62.2,43.97 62.51,44.27 62.51,45.73 C1.1 | U1.13 54.05,43.48 57.45,43.48 58.24,44.27
N$3
  Top 0.305: C4.1 36.03,39.44 U1.48
N$4
  Top 0.305: C5.2 42.7,25.07 U1.73
N$5  (via drill 0.35)
  Top 0.305: LED1.A 7.54,39.93 v7.62,39.93
  Bottom 0.305: R3.1 7.89,41.15 7.89,40.2 v7.62,39.93
N$6
  Top 0.305: U$2.P$14 57.83,23.76 58.34,23.24 58.34,23.04 58.73,22.66 61.01,22.66 61.27,22.91 61.27,24.04 C14.1
N$7  (via drill 0.35, 0.6)
  Top 0.406: IC2.8 46.54,3.87 v46.53,3.86 | IC2.7 45.89,4.5 v46.53,3.86 | IC2.9 47.19,4.52 v46.53,3.86
  Top 0.61: U$26.P$2 23.16,15.66 23.16,20.73 24.38,21.95 33.53,21.95 v34.14,21.34
  Bottom 0.61: v46.53,3.86 46.53,6.91 43.69,9.75 43.69,12.39 41.45,14.63 39.01,14.63 35.05,18.59 35.05,20.42 v34.14,21.34
N$8  (via drill 0.35, 0.6)
  Top 0.406: IC2.37 46.54,19.62 v46.79,19.86 | IC2.36 47.19,19.46 v46.79,19.86 | IC2.38 45.89,19.22 46.28,19.61 46.53,19.61 v46.79,19.86
  Top 0.61: 20.42,22.55 20.42,22.92 | 20.42,22.92 U$26.P$1 | 20.42,22.92 35,22.92 v35.66,22.25
  Bottom 0.61: v46.79,19.86 46.53,19.86 46.28,19.61 46.28,16.56 45.57,15.85 39.62,15.85 36.27,19.2 36.27,21.64 v35.66,22.25
N$9  (via drill 0.35, 0.6)
  Top 0.305: 77.72,12.8 77.51,12.8 U$27.P$1
  Top 0.406: IC2.14 50.44,3.51 v50.6,3.35 | IC2.15 51.09,3.85 v50.6,3.35 | IC2.16 51.74,3.74 51.36,3.35 v50.6,3.35
  Top 0.61: v74.98,15.24 77.15,13.07 U$27.P$1
  Bottom 0.61: v50.6,3.35 50.6,7.42 61.47,18.29 73.76,18.29 74.68,17.37 74.68,15.54 v74.98,15.24
N$10  (via drill 0.35, 0.6)
  Top 0.406: IC2.30 v51.09,19.85 | IC2.31 50.44,19.2 v51.1,19.86 51.74,19.22 IC2.29
  Top 0.61: v51.09,19.85 v51.1,19.86 | 76.63,21.95 77.24,22.55 U$27.P$2 77.24,22.37 v74.98,20.12
  Bottom 0.61: v51.1,19.86 51.1,16.56 52.38,15.29 56.69,15.29 60.68,19.27 73.53,19.27 74.37,20.12 v74.98,20.12
N$11
  Top 0.406: LED2.A 66.68,6.18 R6.1
N$12
  Top 0.406: IC2.41 43.94,17.02 43.48,16.56 39.26,16.56 C17.2
N$13  (via drill 0.6)
  Top 0.305: IC2.2 42.64,6.58 v43.48,7.42
  Bottom 0.305: v43.48,7.42 43.48,6.21 R8.2
N$14
  Top 0.406: IC2.19 53.69,6.96 54.15,7.42 58.64,7.42 C18.1
N$15  (via drill 0.6)
  Top 0.305: IC2.24 54.99,17.4 53.9,16.31 53.65,16.31 v53.39,16.56
  Bottom 0.305: v53.39,16.56 53.39,18.53 R9.1
N$16  (via drill 0.35, 0.6)
  Top 0.305: v3.1,54.66 4.37,53.39 11.23,53.39 11.99,52.63 11.99,49.58 12.5,49.07 14.28,49.07 14.78,48.56 14.78,45.77 16.31,44.25 18.59,44.25 22.91,39.93 v23.52,39.06 | v69.49,24.99 69.49,5.64 v65.08,1.22 64.67,0.81 18.09,0.81 v17.37,1.52 17.37,29.57 v19.51,31.7
  Bottom 0.305: 3.86,55.17 LED3.C 3.89,54.66 v3.1,54.66 | v65.08,1.22 79.47,1.22 LED5.C | LED4.C 92.99,41.78 86.87,35.66 73.46,35.66 68.89,31.09 68.89,25.6 v69.49,24.99 | v17.37,1.52 18.77,1.52 LED6.C | Q4.3 19.51,30.11 v19.51,31.7 19.51,34.79 20.56,35.84 | v23.52,39.06 20.56,35.84 | 20.56,35.84 20.12,35.36
N$17
  Bottom 0.305: LED3.A R13.1
N$18  (via drill 0.35)
  Top 0.61: X4.1 7.24,48.13 5.13,46.02 5.13,43.74 5.89,42.98 5.89,40.44 2.85,37.39 2.85,26.72 3.66,25.91 3.66,12.5 v4.27,11.89
  Bottom 0.61: v4.27,11.89 4.27,9.64 D1.A
N$19
  Bottom 0.305: R14.1 LED4.A
N$20
  Bottom 0.305: U4.5 92.79,18.05 C28.1
N$21
  Bottom 0.305: R15.1 76.56,2.79 78.94,5.18 79.68,5.18 LED5.A
N$22  (via drill 0.6)
  Top 0.305: R21.2 v72.44,77.78
  Bottom 0.305: v72.44,77.78 LED8.C
N$23
  Bottom 0.406: R16.1 20.03,4.9 LED6.A
N$24  (via drill 0.6)
  Top 0.254: R19.2 82.73,76.38 v81.58,77.52
  Bottom 0.254: v81.58,77.52 81.58,77.49 LED7.C
N$25  (via drill 0.6)
  Top 0.305: R23.2 62.92,77.65 v62.79,77.78
  Bottom 0.305: v62.79,77.78 62.79,76.48 LED9.C
N$26  (via drill 0.6)
  Top 0.305: v52.63,77.78 52.63,76.44 R25.2
  Bottom 0.305: v52.63,77.78 52.63,76.98 LED10.C
N$27  (via drill 0.6)
  Top 0.305: v44.5,77.78 44.5,75.93 R27.2
  Bottom 0.305: LED11.C 44.37,77.65 v44.5,77.78
N$28  (via drill 0.6)
  Top 0.305: v34.59,78.03 34.59,75.93 R29.2
  Bottom 0.305: LED12.C 34.47,77.9 v34.59,78.03
N$29  (via drill 0.6)
  Top 0.305: v24.69,78.03 24.69,75.93 R31.2
  Bottom 0.305: LED13.C 24.56,77.9 v24.69,78.03
N$30  (via drill 0.6)
  Top 0.305: v14.53,77.78 14.53,75.93 R33.2
  Bottom 0.305: LED14.C 14.4,77.65 v14.53,77.78
N$31
  Top 0.406: U$30.P$2_EM 9.04,79.78 R37.1 8.75,78.03 U$30.P$3-NC
N$32
  Top 0.305: U$13.P$2_EM 46.47,80.57 U$13.P$3-NC 47.3,78.79 R35.1
N$33
  Top 0.254: U$32.P$2_EM 90,77.23 U$32.P$3-NC 88.19,79.05 R39.1
N$34
  Bottom 0.305: C25.1 7.06,19.25 6.55,18.75 6.36,18.55 6.06,18.25 U3.5
PWM_A_LEFT  (via drill 0.6)
  Top 0.305: IC2.43 42.64,19.69 42.47,19.86 41.45,19.86 v40.44,18.85 | v32.05,34.85 30.53,36.37 30.53,39.42 33.33,42.22 37.5,42.22 U1.42
  Bottom 0.305: v40.44,18.85 39.67,18.85 37.39,21.13 37.39,22.15 39.67,24.43 39.67,28.25 34.59,33.33 33.58,33.33 v32.05,34.85
PWM_A_RIGHT  (via drill 0.6)
  Top 0.305: IC2.21 54.99,4.29 v55.68,3.61 | v29.52,41.71 30.02,41.71 31.55,43.23 37.92,43.23 U1.40
  Bottom 0.305: v55.68,3.61 55.68,3.1 54.41,1.83 36.12,1.83 33.22,4.72 33.22,18.59 26.47,25.35 26.47,27.99 30.02,31.55 30.02,34.85 29.52,35.36 v29.52,41.71
PWM_B_LEFT  (via drill 0.6)
  Top 0.305: IC2.42 43.29,20.18 v43.48,20.37 | v31.55,37.39 31.55,39.42 33.83,41.71 37.32,41.71 U1.43
  Bottom 0.305: v43.48,20.37 43.23,20.62 38.91,20.62 38.41,21.13 38.41,21.64 40.69,23.93 40.69,28.5 34.59,34.59 34.34,34.59 v31.55,37.39
PWM_B_RIGHT  (via drill 0.6)
  Top 0.305: IC2.20 54.34,3.8 v54.15,3.61 | v30.53,40.95 30.53,41.2 32.05,42.72 37.71,42.72 U1.41
  Bottom 0.305: v54.15,3.61 54.15,2.85 53.65,2.34 36.63,2.34 34.14,4.83 34.14,18.9 27.23,25.81 27.23,27.48 30.79,31.04 30.79,35.36 30.53,35.61 v30.53,40.95
RESET
  Top 0.305: U1.14 54.35,44.5 55.42,44.5 56.44,45.52 56.44,47.04 56.69,47.3 65.33,47.3 66.09,46.53 66.09,43.48 66.6,42.98 67.91,42.98 R1.1 70.28,43.12 C3.1 82.69,43.07 84.45,44.82 RESET.3
SCL  (via drill 0.35, 0.6)
  Top 0.305: U$2.P$2 56.81,28.64 56.44,29.01 | 56.44,29.01 54.15,29.01 52.63,27.48 51.55,27.48 U1.83 | 56.44,29.01 59.61,32.18 R5.1 60.88,32.18 v60.25,31.55 | 73.43,40.39 U2.6 71.91,40.51 71.32,39.93 v71.32,36.88
  Bottom 0.305: v60.25,31.55 62.23,33.53 67.97,33.53 v71.32,36.88
SDA  (via drill 0.35, 0.6)
  Top 0.254: U$2.P$3 56.31,27.86 55.93,28.25
  Top 0.305: 55.93,28.25 54.41,28.25 52.88,26.72 | 52.88,26.72 52.63,26.47 51.84,26.47 U1.82 | R4.1 59.87,29.9 v59.49,30.28 | v53.9,26.72 52.88,26.72 | v72.54,36.58 72.54,36.27 71.93,35.66 70.71,35.66 70.41,35.97 70.41,40.54 71.65,41.78 U2.5
  Bottom 0.305: v53.9,26.72 53.77,26.85 53.77,27.61 55.17,29.01 57.2,29.01 58.47,30.28 v59.49,30.28 59.87,29.9 61.52,29.9 64.24,32.61 68.58,32.61 v72.54,36.58
USART1_RX  (via drill 0.6)
  Top 0.305: v23.93,32.82 v32.56,24.18 | v38.15,24.94 39.74,24.94 U1.69 | USART.3 15.27,39.35 15.85,39.93 18.29,39.93 22.15,36.07 v22.15,35.61
  Bottom 0.305: v22.15,35.61 22.15,34.59 v23.93,32.82 | v32.56,24.18 37.39,24.18 v38.15,24.94
USART1_TX  (via drill 0.6)
  Top 0.305: v37.13,26.21 40.3,26.21 U1.68 | v32.56,25.7 24.18,34.09 18.64,34.09 17.37,35.36 13.11,35.36 12.8,35.66 12.8,37.65 USART.2
  Bottom 0.305: v32.56,25.7 36.63,25.7 v37.13,26.21
USBDM
  Top 0.305: U1.70 39.45,23.93 37.13,23.93 18.34,42.72 15.54,42.72 12.24,46.02 12.24,46.79 11.7,47.33 X4.2
USBDP
  Top 0.305: U1.71 39.37,23.16 36.88,23.16 18.09,41.96 15.29,41.96 11.48,45.77 11.48,46.28 11.23,46.53 X4.3
VCC
  Top 0.406: IC2.4 43.94,2.03 43.74,1.83 | IC2.5 44.59,1.92 44.5,1.83 | IC2.6 45.24,2.1 45.52,1.83 | IC2.17 52.39,2.1 52.12,1.83 | IC2.18 53.04,1.92 53.14,1.83 | C18.2 60.41,5.8 60.5,5.89 | IC2.39 45.24,20.39 45.01,20.62 44.59,20.21 IC2.40 | IC2.28 52.39,21.37 52.38,21.39 | IC2.27 53.04,21.04 53.39,21.39 | IC2.26 53.69,21.18 53.9,21.39 | 45.52,21.39 40.18,21.39 38.91,20.12 C17.1 38.83,17.83 37.39,17.83 36.88,17.32 C19.1
  Top 0.813: C23.1 30.87,2.5 31.29,2.08
  Top 1.016: C23.1 29.84,2.4 29.26,1.83 24.69,1.83 23.98,2.54 BAT.2
  Top 1.27: 36.88,3.1 38.15,1.83 43.74,1.83 44.5,1.83 45.52,1.83 52.12,1.83 53.14,1.83 59.74,1.83 60.5,2.59 60.5,5.89 C21.+ 60.59,12.5 62.03,12.5 63.04,13.51 63.04,18.85 60.5,21.39 53.9,21.39 53.39,21.39 52.38,21.39 45.52,21.39 45.01,20.88 45.01,20.62 | C20.+ 36.88,3.1 | 36.88,3.1 35.87,2.08 31.29,2.08
  Bottom 0.61: 15.94,11.05 15.84,10.95 C11.1 12.45,9.6 D1.C
  Bottom 0.813: 15.9,11.02 C10.1 | C10.1 16.37,10.92 IC1.1 18.44,10.87 | 15.94,11.05 C10.1 | 16.15,11.14 C10.1
  Bottom 1.016: 23.98,5.59 BAT.2 23.11,5.49 21.34,5.49 18.29,8.53 18.29,10.72 IC1.1

## Text on the board
tNames: BOOT | IR REMOTE | + | + | USER | - | +